# Altium schematic sheet 21.SchDoc
size 420 x 297 mm
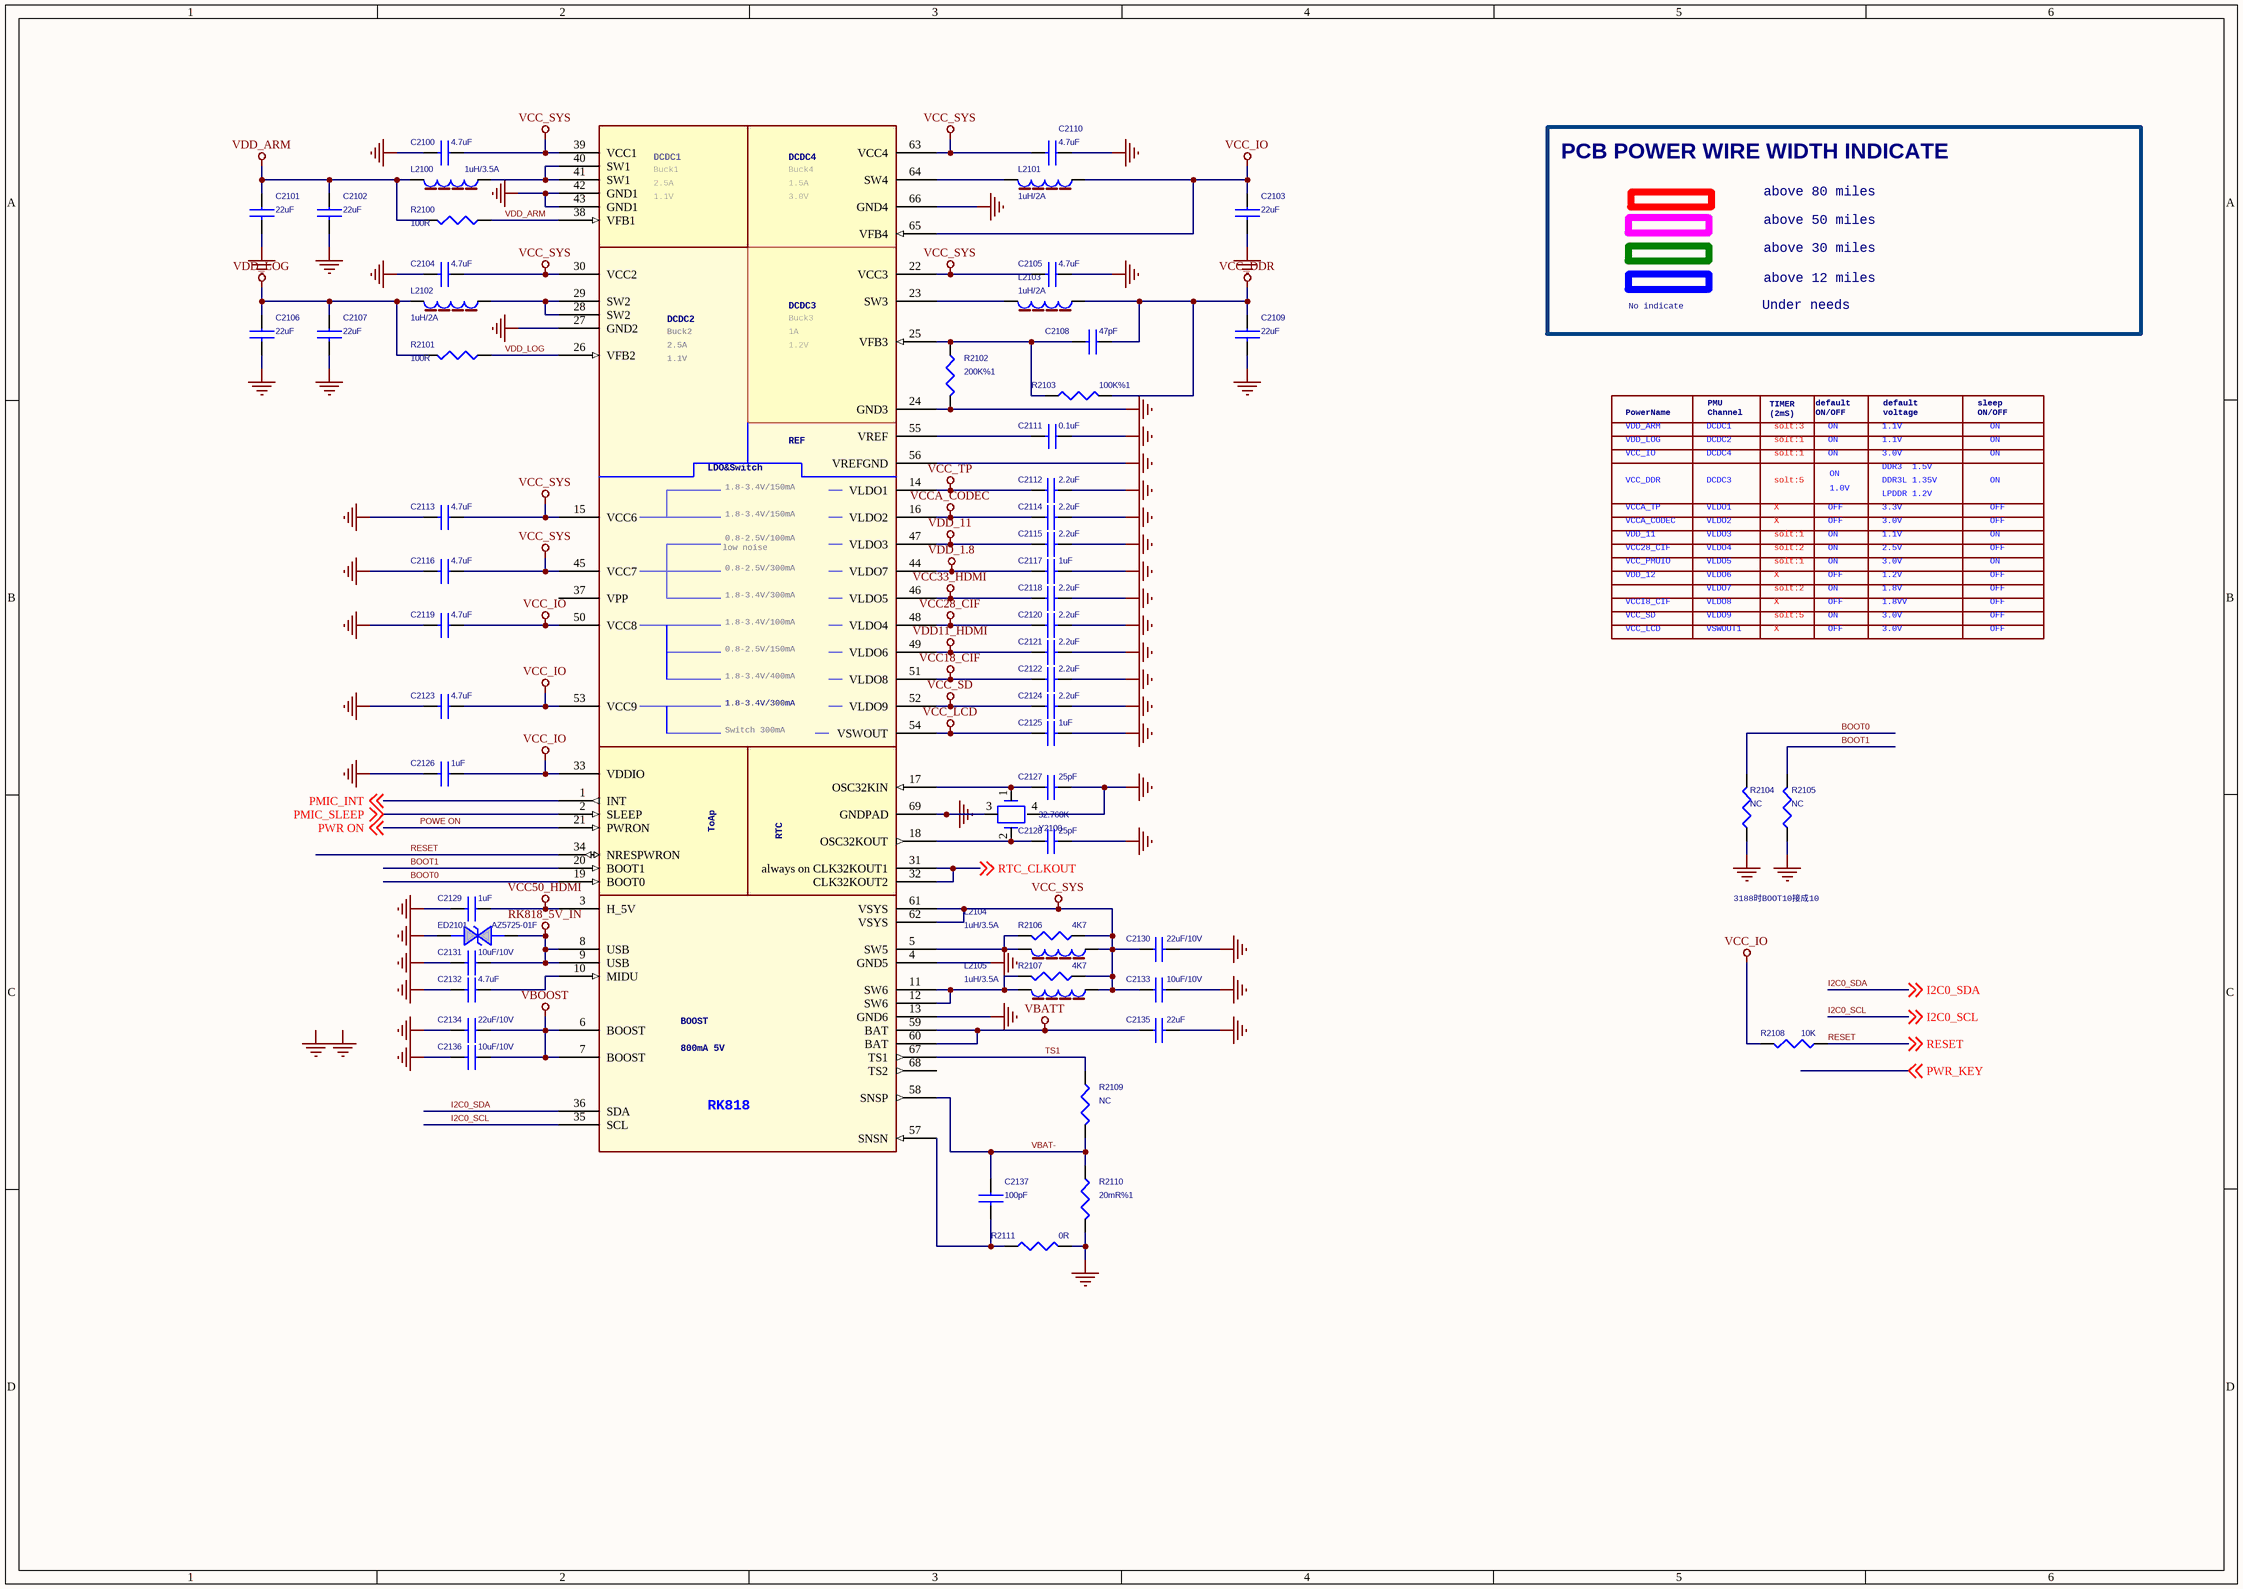
[diagram p0: 21.SchDoc]

## Parts
C2100  4.7uF  [C0603]
C2101  22uF  [C0805]
C2102  22uF  [C0805]
C2103  22uF  [C0805]
C2104  4.7uF  [C0603]
C2105  4.7uF  [C0603]
C2106  22uF  [C0805]
C2107  22uF  [C0805]
C2108  47pF  [C0402]
C2109  22uF  [C0805]
C2110  4.7uF  [C0603]
C2111  0.1uF  [C0402]
C2112  2.2uF  [C0402]
C2113  4.7uF  [C0603]
C2114  2.2uF  [C0402]
C2115  2.2uF  [C0402]
C2116  4.7uF  [C0603]
C2117  1uF  [C0402]
C2118  2.2uF  [C0402]
C2119  4.7uF  [C0603]
C2120  2.2uF  [C0402]
C2121  2.2uF  [C0402]
C2122  2.2uF  [C0402]
C2123  4.7uF  [C0603]
C2124  2.2uF  [C0402]
C2125  1uF  [C0402]
C2126  1uF  [C0402]
C2127  25pF  [C0402]
C2128  25pF  [C0402]
C2129  1uF  [C0402]
C2130  22uF/10V  [C1206]
C2131  10uF/10V  [C0805]
C2132  4.7uF  [C0603]
C2133  10uF/10V  [C0805]
C2134  22uF/10V  [C1206]
C2135  22uF  [C0805]
C2136  10uF/10V  [C0805]
C2137  100pF  [C0402]
ED2101  AZ5725-01F  [E0402]
L2100  1uH/3.5A  [IND-4X4]
L2101  1uH/2A  [IND-3X3]
L2102  1uH/2A  [IND-3X3]
L2103  1uH/2A  [IND-3X3]
L2104  1uH/3.5A  [IND-4X4]
L2105  1uH/3.5A  [IND-4X4]
R2100  100R  [R0402]
R2101  100R  [R0402]
R2102  200K%1  [R0402]
R2103  100K%1  [R0402]
R2104  NC  [R0402]
R2105  NC  [R0402]
R2106  4K7  [R0402]
R2107  4K7  [R0402]
R2108  10K  [R0402]
R2109  NC  [R0402]
R2110  20mR%1  [R1210]
R2111  0R  [R0402]
U2100  RK818  [QFN68]  (value not drawn)
Y2100  32.768K  [CRY_MC146]

## Nets
GND: C2100.2 C2101.2 C2102.2 C2103.2 C2104.2 C2105.1 C2106.2 C2107.2 C2109.2 C2110.1 C2111.1 C2112.2 C2113.2 C2114.2 C2115.2 C2116.2 C2117.2 C2118.2 C2119.2 C2120.2 C2121.2 C2122.2 C2123.2 C2124.2 C2125.2 C2126.2 C2127.2 C2128.2 C2129.2 C2130.2 C2131.2 C2132.2 C2133.2 C2134.2 C2135.2 C2136.2 ED2101.1 R2102.1 R2104.2 R2105.2 R2110.2 R2111.2 U2100.4(GND5) U2100.13(GND6) U2100.24(GND3) U2100.27(GND2) U2100.42(GND1) U2100.43(GND1) U2100.56(VREFGND) U2100.66(GND4) U2100.69(GNDPAD) Y2100.3 Y2100.4
RK818_5V_IN: C2131.1 ED2101.2 U2100.8(USB) U2100.9(USB)
VBATT: C2135.1 U2100.59(BAT) U2100.60(BAT)
VBOOST: C2134.1 C2136.1 U2100.6(BOOST) U2100.7(BOOST)
VCC18_CIF: C2122.1 U2100.51(VLDO8)
VCC28_CIF: C2120.1 U2100.48(VLDO4)
VCC33_HDMI: C2118.1 U2100.46(VLDO5)
VCC50_HDMI: C2129.1 U2100.3(H_5V)
VCC_DDR: C2108.1 C2109.1 L2103.2 R2103.1
VCC_IO: C2103.1 C2119.1 C2123.1 C2126.1 L2101.2 R2108.1 U2100.33(VDDIO) U2100.50(VCC8) U2100.53(VCC9) U2100.65(VFB4)
VCC_LCD: C2125.1 U2100.54(VSWOUT)
VCC_SD: C2124.1 U2100.52(VLDO9)
VCC_SYS: C2100.1 C2104.1 C2105.2 C2110.2 C2113.1 C2116.1 C2130.1 C2133.1 L2104.2 L2105.2 R2106.1 R2107.1 U2100.15(VCC6) U2100.22(VCC3) U2100.30(VCC2) U2100.39(VCC1) U2100.45(VCC7) U2100.61(VSYS) U2100.62(VSYS) U2100.63(VCC4)
VCC_TP: C2112.1 U2100.14(VLDO1)
VCCA_CODEC: C2114.1 U2100.16(VLDO2)
VDD11_HDMI: C2121.1 U2100.49(VLDO6)
VDD_1.8: C2117.1 U2100.44(VLDO7)
VDD_11: C2115.1 U2100.47(VLDO3)
VDD_ARM: C2101.1 C2102.1 L2100.1 R2100.1 R2100.2 U2100.38(VFB1)
VDD_LOG: C2106.1 C2107.1 L2102.1 R2101.1 R2101.2 U2100.26(VFB2)
BOOT0: R2104.1 U2100.19(BOOT0)
BOOT1: R2105.1 U2100.20(BOOT1)
I2C0_SCL: U2100.35(SCL) ; off-sheet I2C0_SCL
I2C0_SDA: U2100.36(SDA) ; off-sheet I2C0_SDA
PMIC_INT: U2100.1(INT) ; off-sheet PMIC_INT
PMIC_SLEEP: U2100.2(SLEEP) ; off-sheet PMIC_SLEEP
POWE ON: U2100.21(PWRON) ; off-sheet PWR ON  [also labelled PWR ON]
RESET: R2108.2 U2100.34(NRESPWRON) ; off-sheet RESET
RTC_CLKOUT: U2100.31(always_on_CLK32KOUT1) U2100.32(CLK32KOUT2) ; off-sheet RTC_CLKOUT
TS1: R2109.1 U2100.67(TS1)
VBAT-: C2137.1 R2109.2 R2110.1 U2100.58(SNSP)
NetC2108_2: C2108.2 R2102.2 R2103.2 U2100.25(VFB3)
NetC2111_2: C2111.2 U2100.55(VREF)
NetC2127_1: C2127.1 U2100.17(OSC32KIN) Y2100.1
NetC2128_1: C2128.1 U2100.18(OSC32KOUT) Y2100.2
NetC2132_1: C2132.1 U2100.10(MIDU)
NetC2137_2: C2137.2 R2111.1 U2100.57(SNSN)
NetL2100_2: L2100.2 U2100.40(SW1) U2100.41(SW1)
NetL2101_1: L2101.1 U2100.64(SW4)
NetL2102_2: L2102.2 U2100.28(SW2) U2100.29(SW2)
NetL2103_1: L2103.1 U2100.23(SW3)
NetL2104_1: L2104.1 R2106.2 U2100.5(SW5)
NetL2105_1: L2105.1 R2107.2 U2100.11(SW6) U2100.12(SW6)

Not connected (* = marked no-connect by the designer): U2100 37(VPP) 68(TS2)

## Notes on the sheet
- PCB POWER WIRE WIDTH INDICATE
- above 30 miles
- above 50 miles
- above 80 miles
- No indicate
- Under needs
- above 12 miles
- VDD_ARM
- VCC_IO
- VDD_LOG
- PowerName
- PMU
  Channel
- DCDC4
- DCDC1
- DCDC2
- TIMER
  (2mS)
- solt:1
- solt:3
- default
  ON/OFF
- ON
- 1.1V
- default
  voltage
- 3.0V
- sleep
  ON/OFF
- VCC_DDR
- VCCA_TP
- VCCA_CODEC
- DCDC3
- VLDO2
- VLDO1
- solt:5
- X
- OFF
- 1.0V
- 3.3V
- DDR3  1.5V
- LPDDR 1.2V
- DDR3L 1.35V
- VDD_11
- VCC_PMUIO
- VCC28_CIF
- VDD_12
- VLDO4
- VLDO5
- VLDO3
- VLDO7
- VLDO6
- solt:2
- 1.2V
- 1.8V
- 2.5V
- VCC_SD
- VCC_LCD
- VCCI8_CIF
- VSWOUT1
- VLDO8
- VLDO9
- 1.8VV
- 3188时BOOT10接成10
- (near U2100) RK818
- Labels drawn without touching a wire or pin: GND
- (in symbol RK818_1) DCDC1; DCDC4; Buck1; Buck4; 2.5A; 1.5A; 1.1V; 3.0V; DCDC3; Buck3; DCDC2; Buck2; 1A; 1.2V; REF; LDO&Switch; 1.8-3.4V/150mA; 0.8-2.5V/100mA; low noise; 0.8-2.5V/300mA; 1.8-3.4V/300mA; 1.8-3.4V/100mA; 0.8-2.5V/150mA; 1.8-3.4V/400mA; Switch 300mA; ToAp; RTC; 800mA 5V

## Library data of the parts
C2100-C2137 = CAP NP_4
ED2101 = DIODE BI-DIR TRIG: ESD
L2100-L2105 = INDUCTOR_2: ROOM: USB+5V
R2100-R2108 = RESISTOR_1: RES,thick film,47KOhm,+/-5%,1/16W,SMD0402
R2109 R2111 = RESISTOR_1: 贴片电阻; ROOM: USB+5V; MARK: 2K
R2110 = RESISTOR_1: 贴片电阻; MARK: 2K; ROOM: USB+5V
U2100 = RK818_1
Y2100 = CRYSTAL_0: Crystal,32.768KHz,+/-30ppm,12pF,MC146,-10°C ~ +60   °C; Part Type: 晶体类\无源晶体